# Altium schematic sheet Acoustic, Light, Motion Sensors.SchDoc: Acoustic, Light, & Motion Sensors
size B; Organization: Drexel University; Address1: ECE Senior Design; Address2: 2018-2019; Address3: ECE-08; Revision: 1.0; SheetNumber: 10; SheetTotal: 10
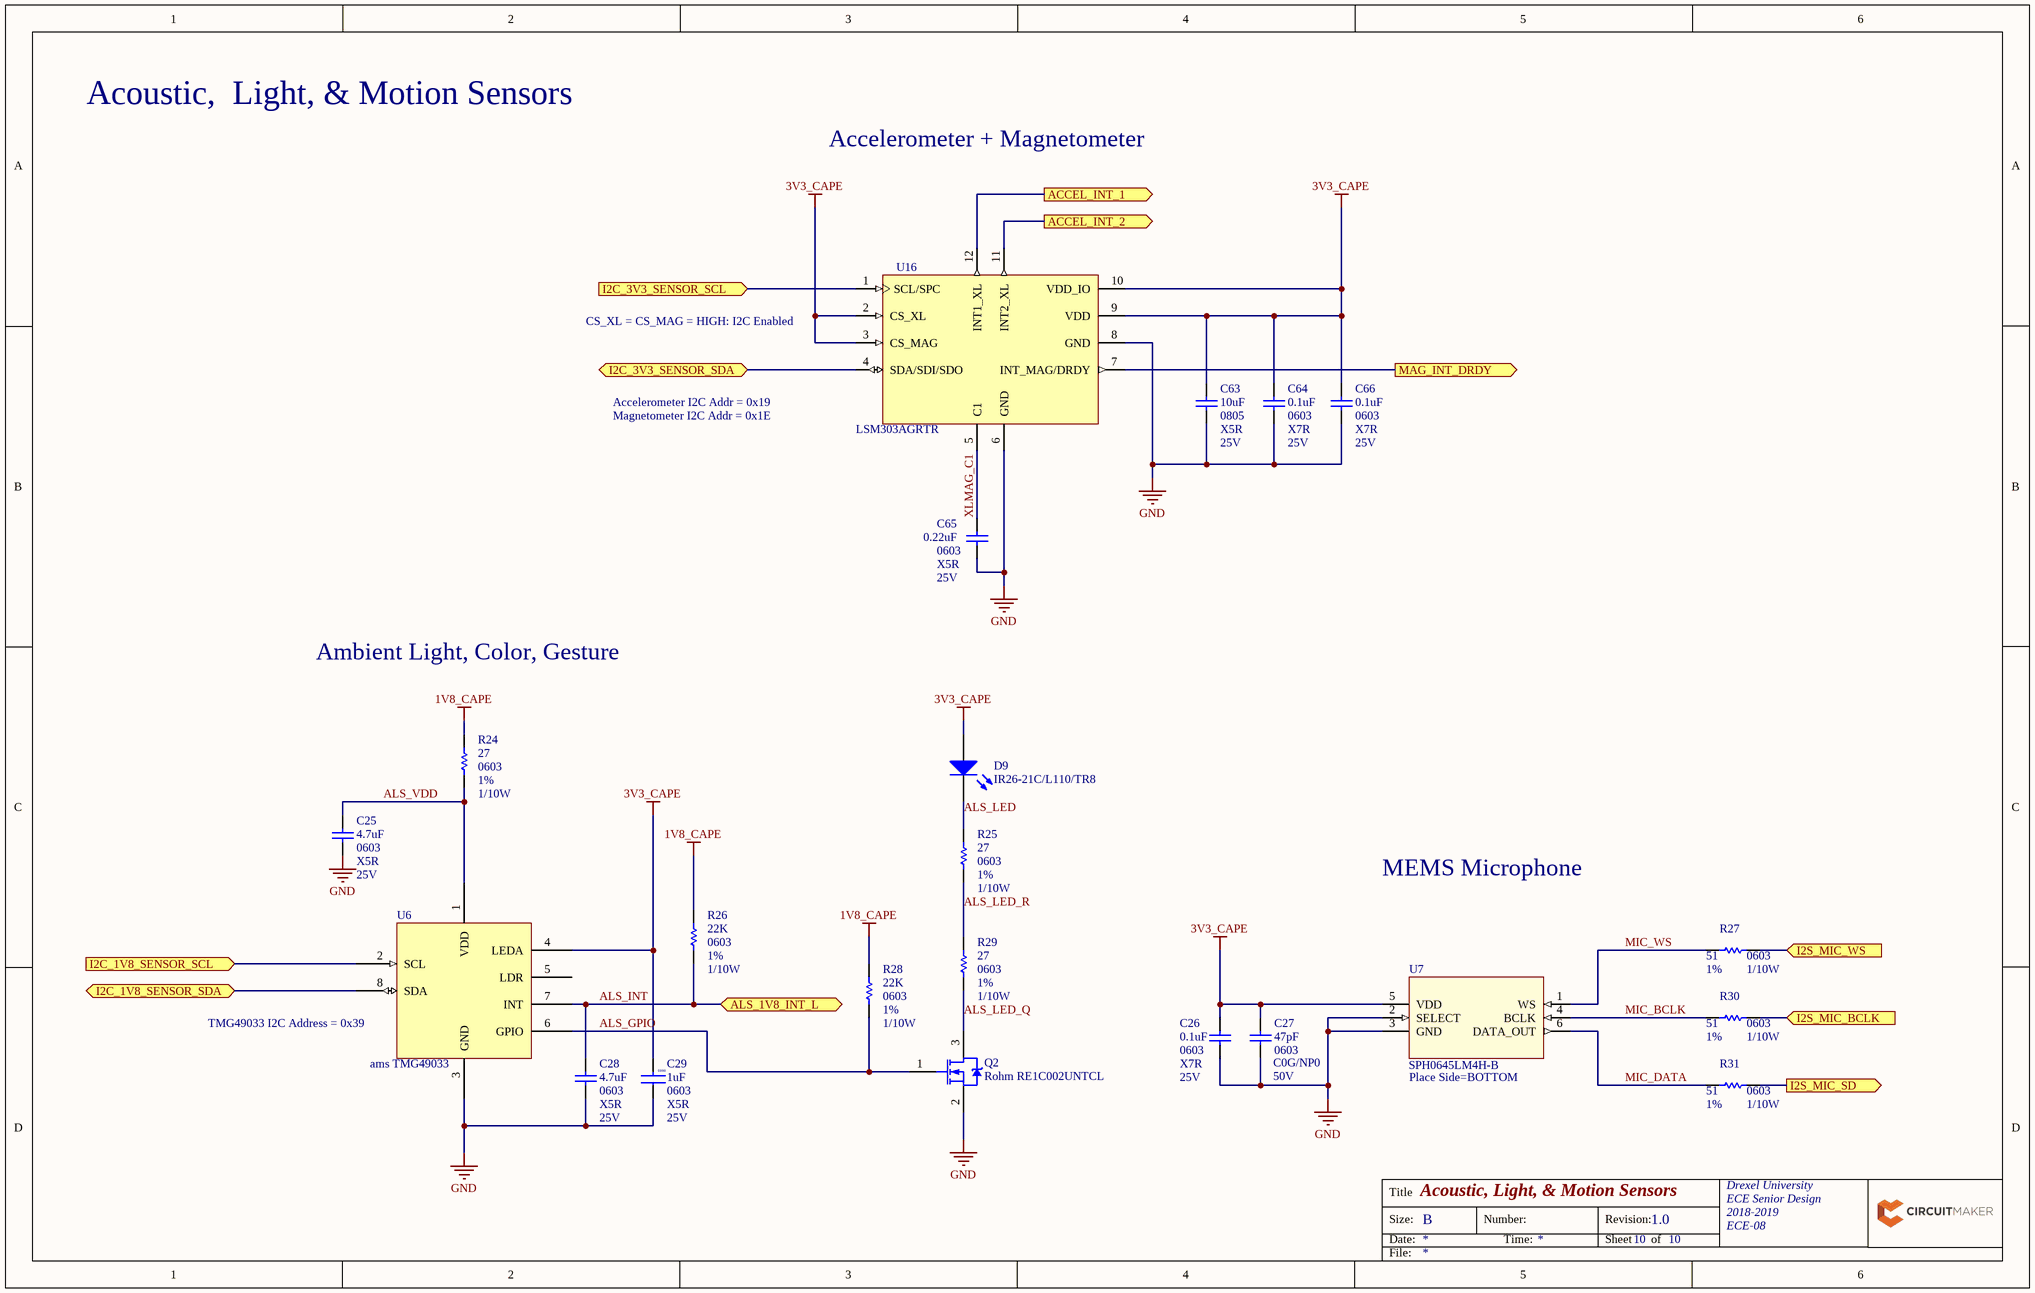
[diagram p0: Acoustic, Light, Motion Sensors.SchDoc]

## Parts
C25  Capacitance: 4.7uF  Case/Package: 0603  Dielectric Characteristic: X5R  Voltage Rating (DC): 25V  [CAPC1608X90X35ML10T15]  (hidden comment: Murata GRM188R61E475KE11D)
C26  Dielectric Characteristic: X7R  Voltage Rating (DC): 25V  Capacitance: 0.1uF  Package: 0603  [PCB-8usp83j76ntw2xroyu3n-1]  (hidden comment: Würth Elektronik 885012206071)
C27  Capacitance: 47pF  Dielectric Characteristic: C0G/NP0  Voltage Rating (DC): 50V  Package: 0603  [PCB-6hp2bdit6vqlyhs5eujf-1]  (hidden comment: Würth Elektronik 885012006055)
C28  Capacitance: 4.7uF  Case/Package: 0603  Dielectric Characteristic: X5R  Voltage Rating (DC): 25V  [CAPC1608X90X35ML10T15]  (hidden comment: Murata GRM188R61E475KE11D)
C29  Case/Package: 0603  Dielectric Characteristic: X5R  Capacitance: 1uF  Voltage Rating (DC): 25V  [PCB-bncvufzharetcg4gy1u6-1]  (hidden comment: Taiyo Yuden TMK107BJ105KA-T)
C63  Voltage Rating (DC): 25V  Package: 0805  Capacitance: 10uF  Temperature Coefficient: X5R  [Capacitor_0805]  (hidden comment: Murata GRM21BR61E106MA73L)
C64  Dielectric Characteristic: X7R  Voltage Rating (DC): 25V  Capacitance: 0.1uF  Package: 0603  [PCB-8usp83j76ntw2xroyu3n-1]  (hidden comment: Würth Elektronik 885012206071)
C65  Case/Package: 0603  Capacitance: 0.22uF  Temperature Coefficient: X5R  Voltage Rating: 25V  [PCB-eliu6zwwm13rwakn7csa-1]  (hidden comment: Würth Elektronik 885012106019)
C66  Dielectric Characteristic: X7R  Voltage Rating (DC): 25V  Capacitance: 0.1uF  Package: 0603  [PCB-8usp83j76ntw2xroyu3n-1]  (hidden comment: Würth Elektronik 885012206071)
D9  IR26-21C/L110/TR8  [1206_A]
Q2  Rohm RE1C002UNTCL  [PCB-cy8fr5d7bejv46iuepu9-1]
R24  Resistance: 27  Power Rating: 1/10W  Case/Package: 0603  Resistance Tolerance: 1%  [0603-RES]  (hidden comment: Panasonic / Panasonic ECG ERJ-3EKF27R0V)
R25  Resistance: 27  Power Rating: 1/10W  Case/Package: 0603  Resistance Tolerance: 1%  [0603-RES]  (hidden comment: Panasonic / Panasonic ECG ERJ-3EKF27R0V)
R26  Resistance: 22K  Resistance Tolerance: 1%  Case/Package: 0603  Power Rating: 1/10W  [RESC1608X55X25LL10T15]  (hidden comment: Yageo RC0603FR-0722KL)
R27  Case/Package: 0603  Power Rating: 1/10W  Resistance: 51  Resistance Tolerance: 1%  [PCB-9ahxsq8gddjqcnfjmojj-1]  (hidden comment: Stackpole Electronics RMCF0603FT51R0)
R28  Resistance: 22K  Resistance Tolerance: 1%  Case/Package: 0603  Power Rating: 1/10W  [RESC1608X55X25LL10T15]  (hidden comment: Yageo RC0603FR-0722KL)
R29  Resistance: 27  Power Rating: 1/10W  Case/Package: 0603  Resistance Tolerance: 1%  [0603-RES]  (hidden comment: Panasonic / Panasonic ECG ERJ-3EKF27R0V)
R30  Case/Package: 0603  Power Rating: 1/10W  Resistance: 51  Resistance Tolerance: 1%  [PCB-9ahxsq8gddjqcnfjmojj-1]  (hidden comment: Stackpole Electronics RMCF0603FT51R0)
R31  Case/Package: 0603  Power Rating: 1/10W  Resistance: 51  Resistance Tolerance: 1%  [PCB-9ahxsq8gddjqcnfjmojj-1]  (hidden comment: Stackpole Electronics RMCF0603FT51R0)
U6  ams TMG49033  [LGA8C102P2X4_200X500X107]
U7  Manufacturer Part Number: SPH0645LM4H-B  [SPH-MEMS]  (hidden comment: PH0645LM4H-B)
U16  LSM303AGRTR  [PCB-zxk1k6ks26krobft08qb-1]

## Ports
ACCEL_INT_1 (out), ACCEL_INT_2 (out), ALS_1V8_INT_L, I2C_1V8_SENSOR_SCL (in), I2C_1V8_SENSOR_SDA (bidir), I2C_3V3_SENSOR_SCL (in), I2C_3V3_SENSOR_SDA (bidir), I2S_MIC_BCLK (in), I2S_MIC_SD (out), I2S_MIC_WS (in), MAG_INT_DRDY (out)

## Nets
1V8_CAPE: R24.2 R26.2 R28.2
3V3_CAPE: C26.2 C27.2 C29.2 C63.2 C64.2 C66.2 D9.1 U6.4(LEDA) U7.5(VDD) U16.2(CS_XL) U16.3(CS_MAG) U16.9(VDD) U16.10(VDD_IO)
GND: C25.2 C26.1 C27.1 C28.2 C29.1 C63.1 C64.1 C65.1 C66.1 Q2.2(S) U6.3(GND) U7.2(SELECT) U7.3(GND) U16.6(GND) U16.8(GND)
ACCEL_INT_1: U16.12(INT1_XL) ; port ACCEL_INT_1
ACCEL_INT_2: U16.11(INT2_XL) ; port ACCEL_INT_2
ALS_GPIO: Q2.1(G) R28.1 U6.6(GPIO)
ALS_INT: C28.1 R26.1 U6.7(INT) ; port ALS_1V8_INT_L
ALS_LED: D9.2 R25.2
ALS_LED_Q: Q2.3(D) R29.1
ALS_LED_R: R25.1 R29.2
ALS_VDD: C25.1 R24.1 U6.1(VDD)
I2C_1V8_SENSOR_SCL: U6.2(SCL) ; port I2C_1V8_SENSOR_SCL
I2C_1V8_SENSOR_SDA: U6.8(SDA) ; port I2C_1V8_SENSOR_SDA
I2C_3V3_SENSOR_SCL: U16.1(SCL/SPC) ; port I2C_3V3_SENSOR_SCL
I2C_3V3_SENSOR_SDA: U16.4(SDA/SDI/SDO) ; port I2C_3V3_SENSOR_SDA
I2S_MIC_BCLK: R30.2 ; port I2S_MIC_BCLK
I2S_MIC_SD: R31.2 ; port I2S_MIC_SD
I2S_MIC_WS: R27.2 ; port I2S_MIC_WS
MAG_INT_DRDY: U16.7(INT_MAG/DRDY) ; port MAG_INT_DRDY
MIC_BCLK: R30.1 U7.4(BCLK)
MIC_DATA: R31.1 U7.6(DATA_OUT)
MIC_WS: R27.1 U7.1(WS)
XLMAG_C1: C65.2 U16.5(C1)

Not connected (* = marked no-connect by the designer): U6 5(LDR)

## Notes on the sheet
- Acoustic,  Light, & Motion Sensors
- Accelerometer + Magnetometer
- CS_XL = CS_MAG = HIGH: I2C Enabled
- Accelerometer I2C Addr = 0x19
- Magnetometer I2C Addr = 0x1E
- Ambient Light, Color, Gesture
- MEMS Microphone
- (near U6) TMG49033 I2C Address = 0x39
- (near U7) Place Side=BOTTOM
- Title
- Size:
- Date:
- B
- Number:
- Time:
- Revision:
- Sheet
- of
- File:

## Library data of the parts
C25 C28 = CMP-8856396-4: CAP CER 4.7UF 25V 10% X5R 0603; Capacitance Tolerance: ±10%; Lifecycle Status: Active; Octopart Url: https://octopart.com/grm188r61e475ke11d-murata-26982327; OctopartID: 0176c9e793a7deb1; Packaging: Cut Tape (CT); REACH SVHC Compliance: No SVHC; RoHS: Compliant; Size-Length: 0.0016 m; Size-Thickness: 0.0008 m; Size-Width: 0.0008 m; Manufacturer Part Number: GRM188R61E475KE11D
C26 C64 C66 = CMP-034ac9768ab0dc8d-1: Multilayer Ceramic Capacitor, WCAP-CSGP Series, 0.1 F, 10%, X7R, 25 V, 0603 [1608 Metric]; RoHS: Compliant; Capacitance Tolerance: ±10%; OctopartID: 034ac9768ab0dc8d; Packaging: Cut Tape (CT); Octopart URL: http://octopart.com/885012206071-w%C3%BCrth+elektronik-53914780; Manufacturer Part Number: 885012206071
C27 = CMP-bdcf7723a1936208-1: Cap, Mlcc, Np0, 47Pf, 50V, 0603; Capacitance Tolerance: ±5%; Octopart URL: https://octopart.com/885012006055-w%C3%BCrth+elektronik-65419578; Manufacturer Part Number: 885012006055; Operating Temperature: -55.0 °C (min); Packaging: Cut Tape (CT); RoHS: Compliant; OctopartID: bdcf7723a1936208
C29 = CMP-ac4e65478e587389-1: Cap Ceramic 1uF 25V X5R 10% SMD 0603 85°C Paper T/R; Lead-Free Status: Lead Free; Octopart URL: http://octopart.com/tmk107bj105ka-t-taiyo+yuden-198512; Packaging: Cut Tape (CT); Size-Width: 800 µm; Halogen Free Status: Halogen Free; Size-Length: 1.60 mm; Capacitance Tolerance: ±10%; OctopartID: ac4e65478e587389; Size-Height: 800 µm; Mounting Style: Surface Mount; Manufacturer Part Number: TMK107BJ105KA-T; Lifecycle Status: Active; Number of Pins: 2; RoHS: Compliant
C63 = CMP-3dadf66f6462e26a-3: 0805 25 V 10 uF ±20% Tolerance X5R Multilayer Ceramic Capacitor; Case/Package (SI): 2012; Size-Length: 2.00 mm; OctopartID: 3dadf66f6462e26a; RoHS: Compliant; Lifecycle Status: Active
C65 = CMP-d2ee18d25bec0d29-1: Cap Cer 0.22UF 25V X5R 0603; Capacitance Tolerance: ±20%; Manufacturer Part No.: 885012106019; Octopart URL: https://octopart.com/885012106019-w%C3%BCrth+elektronik-53914724; Manufacturer Part Number: 885012106019; Mounting Style: Surface Mount; Packaging: Tape & Reel (TR); OctopartID: d2ee18d25bec0d29
D9 = CMP-1542916-2: LED IR SUBMINI 1.6MM ROUND SMD; Lead-Free Status: Lead Free; Manufacturer Part Number: IR26-21C/L110/TR8; Octopart Url: https://octopart.com/ir26-21c%2Fl110%2Ftr8-everlight-18582662; OctopartID: 43218b30eac19ce6; RoHS: Compliant
Q2 = CMP-817649b5405f5eb1-2: MOSFET N-CH 20V 0.2A EMT3; Manufacturer: Rohm Semiconductor; Vendor Part Number: RE1C002UNTCLCT-ND; Cost Vendor: 0.181 per 10; FET Type: MOSFET N-Channel, Metal Oxide; Lead-Free Status: Lead Free; Vendor: Digikey; Current - Continuous Drain (Id) @ 25°C: 200mA (Ta); FET Feature: Logic Level Gate, 1.2V Drive; OctopartID: 817649b5405f5eb1; Octopart URL: http://octopart.com/re1c002untcl-rohm-30008399; Drain to Source Voltage (Vdss): 20V; Cost: 0.20; Package / Case: SC-75, SOT-416; Manufacturer Part Number: RE1C002UNTCL; RoHS: Compliant
R24 R25 R29 = CMP-f61f3f990ffb29d8-2: Res Thick Film 0603 27 Ohm 1% 0.1W(1/10W) ±100ppm/C Molded SMD Automotive Punched T/R; Lead-Free Status: Lead Free; Voltage Rating (DC): 75.0 V; Manufacturer Part Number: ERJ-3EKF27R0V; RoHS: Compliant; OctopartID: f61f3f990ffb29d8; Number of Pins: 2; Mounting Style: Surface Mount; Seller Landing  Url: https://octopart-clicks.com/click/track?country=US&ak=8157f166&sig=00bb2fd&sid=459&ppid=9231490&vpid=115259536&ct=offers; Lifecycle Status: Not Listed by Manufacturer; Octopart Url: http://octopart.com/erj-3ekf27r0v-panasonic-9231490; REACH SVHC Compliance: No SVHC; Packaging: Tape & Reel (TR), Cut Tape (CT)
R26 R28 = CMP-1853446-5: Chip Resistor, 22 KOhm, +/- 1%, 0.1 W, -55 to 155 degC, 0603 (1608 Metric), RoHS, Tape and Reel; Voltage Rating (DC): 50.0 V; Lead-Free Status: Lead Free; Case/Package (SI): 1608; Number of Pins: 2; Size-Height: 450 µm; PackageDescription: 2-Pin Surface Mount Device, Body 1.6 x 0.8 mm; Size-Width: 800 µm; Seller Landing  Url: https://octopart-clicks.com/click/track?country=US&ak=8157f166&sig=0952a08&sid=5489&ppid=40952860&vpid=270386233&ct=offers; DatasheetVersion: Rev. 4, 02/2016; PackageReference: 0603; Size-Length: 1.60 mm; RoHS: Compliant; Mounting Style: Surface Mount; OctopartID: 2162ea18e018fea5; Manufacturer Part Number: RC0603FR-0722KL; Packaging: Cut Tape (CT), Tape & Reel (TR); Octopart Url: http://octopart.com/rc0603fr-0722kl-yageo-40952860; REACH SVHC Compliance: No SVHC
R27 R30 R31 = CMP-c18a09a5cf0a1e4d-2: Res Thick Film 0603 51 Ohm 1% 0.1W(1/10W) ???}100ppm/??? Molded SMD Automotive Paper T/R; Lead-Free Status: Lead Free; Mounting Style: Surface Mount; RoHS: Compliant; Packaging: Tape & Reel (TR); Manufacturer Part Number: RMCF0603FT51R0; OctopartID: c18a09a5cf0a1e4d; Octopart URL: https://octopart.com/rmcf0603ft51r0-stackpole+electronics-19213286
U6 = CMP-5d86977545368241-2: Gesture, Color and Proximity Sensor Module Digital Output 1.8V 8-Pin T/R
U7 = CMP-f6813c2c61792946-5: Mic Mems Digital I2s Omni -26db; OctopartID: f6813c2c61792946
U16 = CMP-98f6527696964731-3: Ultra-compact high-performance eCompass module: ultra-low power 3D accelerometer and 3D magnetometer; Lifecycle Status: Active; Octopart URL: http://octopart.com/lsm303agrtr-stmicroelectronics-59386630; Manufacturer Part Number: LSM303AGRTR; Packaging: Cut Tape (CT); RoHS: Compliant